# EAGLE schematic warp-revA (EAGLE 8.6.3)

## Sheet 1 of 5
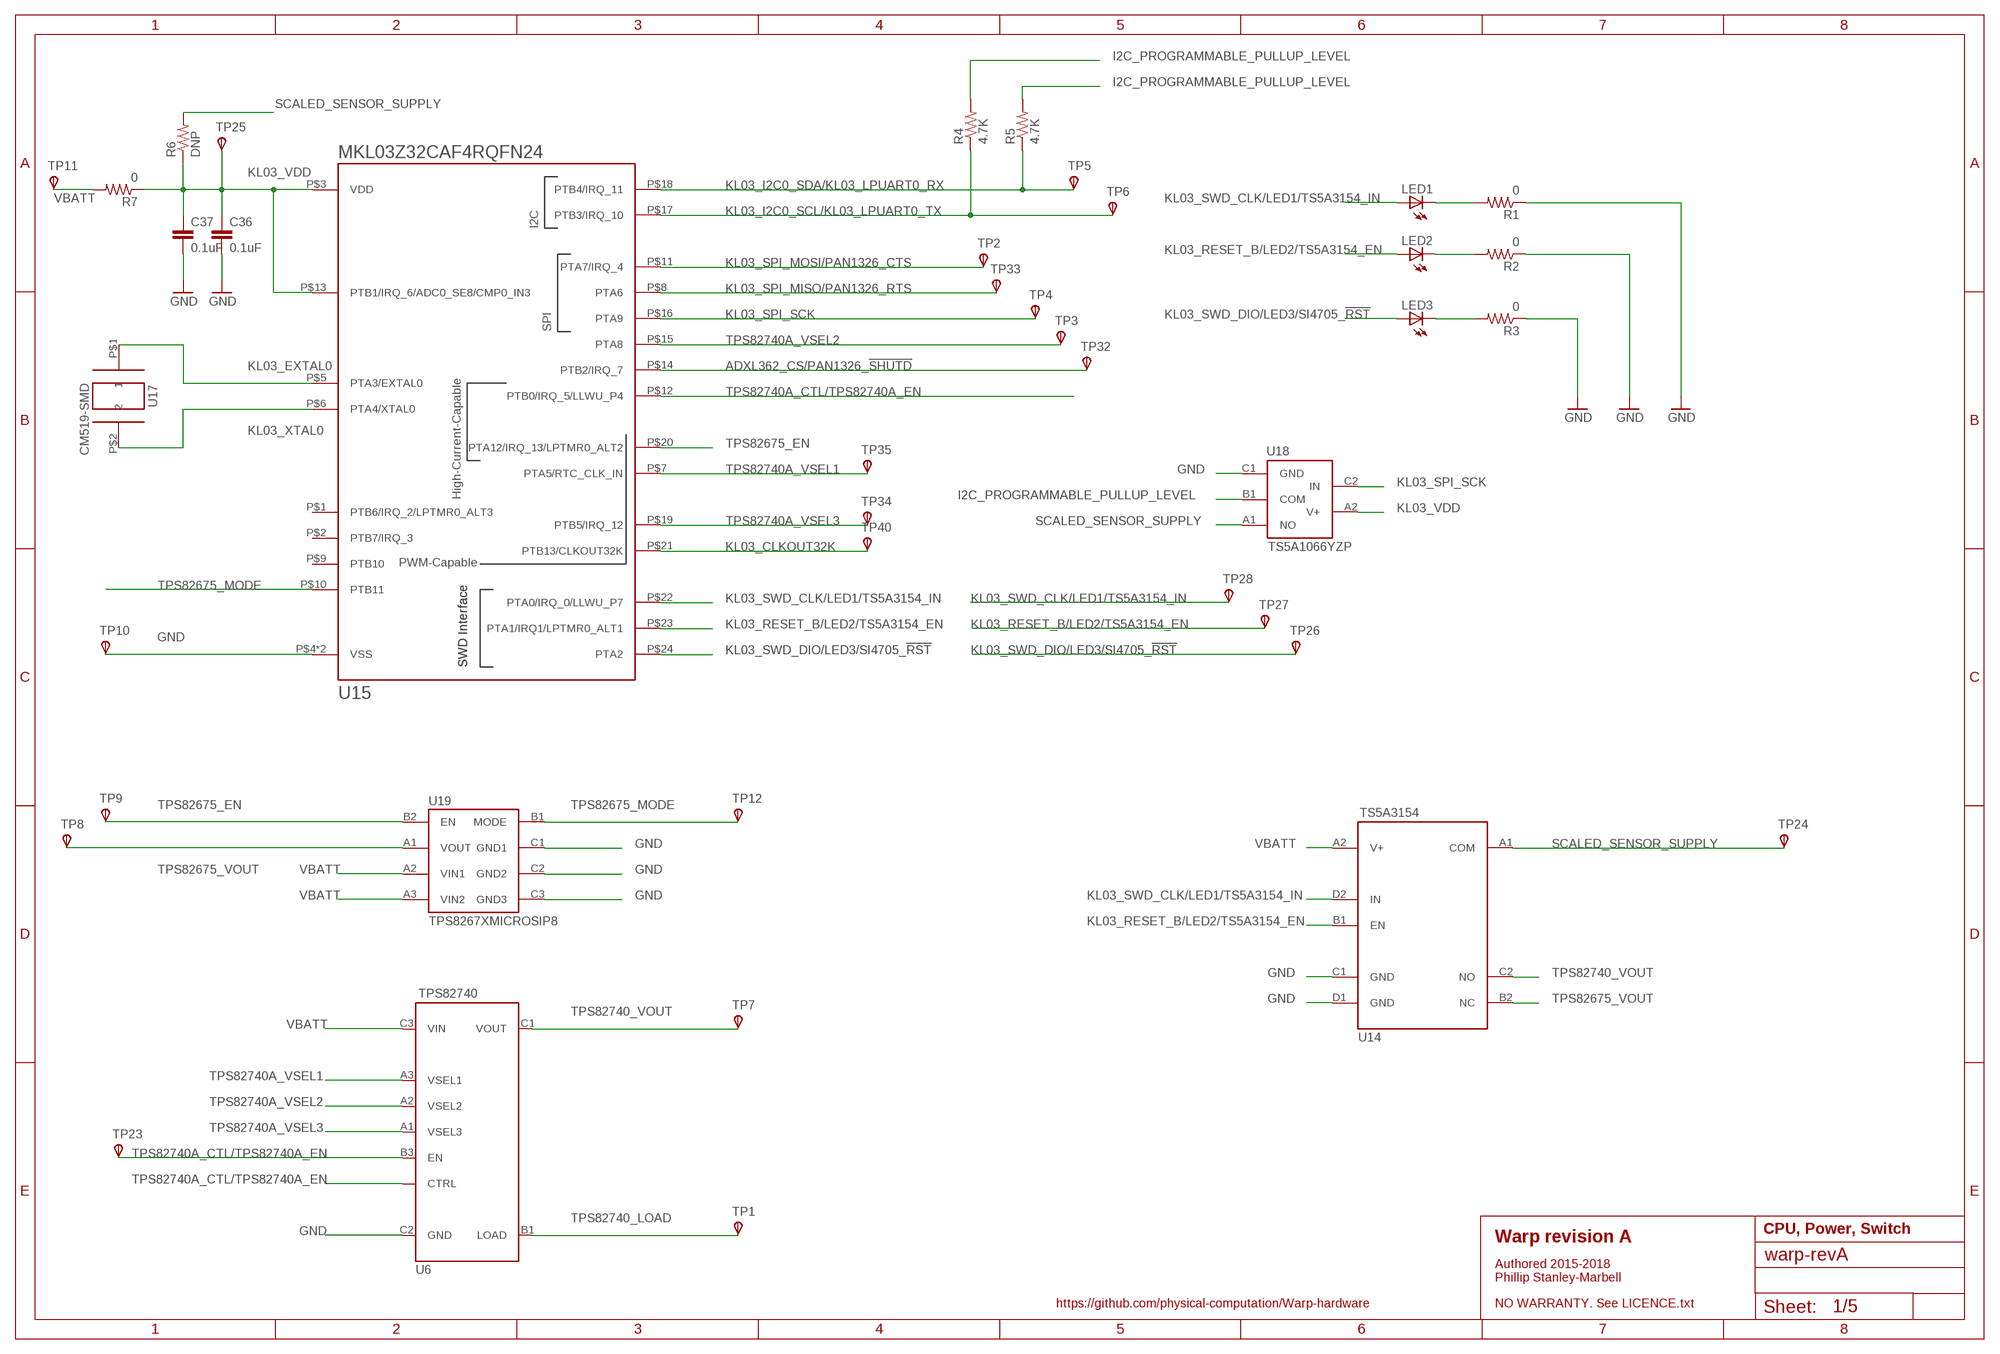
[diagram p0: schematic, sheet 1]

### Parts
C36  0.1uF  CAP0402-CAP  [0402-CAP]
C37  0.1uF  CAP0402-CAP  [0402-CAP]
LED1  LEDSML0603  [SML0603]
LED2  LEDSML0603  [SML0603]
LED3  LEDSML0603  [SML0603]
R1  0  RESISTOR0402-RES  [0402-RES]
R2  0  RESISTOR0402-RES  [0402-RES]
R3  0  RESISTOR0402-RES  [0402-RES]
R4  4.7K  RESISTOR0402-RES  [0402-RES]
R5  4.7K  RESISTOR0402-RES  [0402-RES]
R6  DNP  RESISTOR0402-RES  [0402-RES]
R7  0  RESISTOR0402-RES  [0402-RES]
TP1  TPSTP06R  [TP06R]
TP2  TPSTP06R  [TP06R]
TP3  TPSTP06R  [TP06R]
TP4  TPSTP06R  [TP06R]
TP5  TPSTP06R  [TP06R]
TP6  TPSTP06R  [TP06R]
TP7  TPSTP06R  [TP06R]
TP8  TPSTP06R  [TP06R]
TP9  TPSTP06R  [TP06R]
TP10  TPSTP06R  [TP06R]
TP11  TPSTP06R  [TP06R]
TP12  TPSTP06R  [TP06R]
TP23  TPSTP06R  [TP06R]
TP24  TPSTP06R  [TP06R]
TP25  TPSTP06R  [TP06R]
TP26  TPSTP06R  [TP06R]
TP27  TPSTP06R  [TP06R]
TP28  TPSTP06R  [TP06R]
TP32  TPSTP06R  [TP06R]
TP33  TPSTP06R  [TP06R]
TP34  TPSTP06R  [TP06R]
TP35  TPSTP06R  [TP06R]
TP40  TPSTP06R  [TP06R]
U6  TPS82740  [TPS82740]
U14  TS5A3154  [TS5A3154]
U15  MKL03Z32CAF4RQFN24  [MKL03Z32VFK4R]
U17  CM519-SMD  [CM519]
U18  TS5A1066YZP  [R-XBGA-N5]
U19  TPS8267XMICROSIP8  [MICROSIP-8]

### Nets
ADXL362_CS/PAN1326_!SHUTD: TP32.TP(PP) U15.P$14(PTB2/IRQ_7) ; also sheet 2,3
GND: C36.2 C37.2 R1.1 R2.1 R3.1 TP10.TP(PP) U6.C2(GND) U14.C1(GND) U14.D1(GND) U15.P$4(VSS) U15.P$PAD(VSS) U18.C1(GND) U19.C1(GND1) U19.C2(GND2) U19.C3(GND3) ; also sheet 2,3,4,5
I2C_PROGRAMMABLE_PULLUP_LEVEL: R4.2 R5.2 U18.B1(COM)
KL03_CLKOUT32K: TP40.TP(PP) U15.P$21(PTB13/CLKOUT32K) ; also sheet 3
KL03_EXTAL0: U15.P$5(PTA3/EXTAL0) U17.P$1
KL03_I2C0_SCL/KL03_LPUART0_TX: R4.1 TP6.TP(PP) U15.P$17(PTB3/IRQ_10) ; also sheet 2,3
KL03_I2C0_SDA/KL03_LPUART0_RX: R5.1 TP5.TP(PP) U15.P$18(PTB4/IRQ_11) ; also sheet 2,3
KL03_RESET_B/LED2/TS5A3154_EN: LED2.A TP27.TP(PP) U14.B1(EN) U15.P$23(PTA1/IRQ1/LPTMR0_ALT1) ; also sheet 5
KL03_SPI_MISO/PAN1326_RTS: TP33.TP(PP) U15.P$8(PTA6) ; also sheet 2,3
KL03_SPI_MOSI/PAN1326_CTS: TP2.TP(PP) U15.P$11(PTA7/IRQ_4) ; also sheet 2,3
KL03_SPI_SCK: TP4.TP(PP) U15.P$16(PTA9) U18.C2(IN) ; also sheet 2
KL03_SWD_CLK/LED1/TS5A3154_IN: LED1.A TP28.TP(PP) U14.D2(IN) U15.P$22(PTA0/IRQ_0/LLWU_P7) ; also sheet 5
KL03_SWD_DIO/LED3/SI4705_!RST: LED3.A TP26.TP(PP) U15.P$24(PTA2) ; also sheet 3,5
KL03_VDD: C36.1 C37.1 R6.1 R7.1 TP25.TP(PP) U15.P$3(VDD) U15.P$13(PTB1/IRQ_6/ADC0_SE8/CMP0_IN3) U18.A2(V+)
KL03_XTAL0: U15.P$6(PTA4/XTAL0) U17.P$2
N$1: LED1.C R1.2
N$2: LED2.C R2.2
N$3: LED3.C R3.2
SCALED_SENSOR_SUPPLY: R6.2 TP24.TP(PP) U14.A1(COM) U18.A1(NO) ; also sheet 2,3
TPS82675_EN: TP9.TP(PP) U15.P$20(PTA12/IRQ_13/LPTMR0_ALT2) U19.B2(EN)
TPS82675_MODE: TP12.TP(PP) U15.P$10(PTB11) U19.B1(MODE)
TPS82675_VOUT: TP8.TP(PP) U14.B2(NC) U19.A1(VOUT)
TPS82740_LOAD: TP1.TP(PP) U6.B1(LOAD)
TPS82740_VOUT: TP7.TP(PP) U6.C1(VOUT) U14.C2(NO)
TPS82740A_CTL/TPS82740A_EN: TP23.TP(PP) U6.B2(CTRL) U6.B3(EN) U15.P$12(PTB0/IRQ_5/LLWU_P4)
TPS82740A_VSEL1: TP35.TP(PP) U6.A3(VSEL1) U15.P$7(PTA5/RTC_CLK_IN)
TPS82740A_VSEL2: TP3.TP(PP) U6.A2(VSEL2) U15.P$15(PTA8)
TPS82740A_VSEL3: TP34.TP(PP) U6.A1(VSEL3) U15.P$19(PTB5/IRQ_12)
VBATT: R7.2 TP11.TP(PP) U6.C3(VIN) U14.A2(V+) U19.A2(VIN1) U19.A3(VIN2) ; also sheet 4,5
Unconnected: U15.P$1(PTB6/IRQ_2/LPTMR0_ALT3) U15.P$2(PTB7/IRQ_3) U15.P$9(PTB10)

### Notes on the sheet
- CPU, Power, Switch
- Warp revision A
- Authored 2015-2018
  Phillip Stanley-Marbell
- https://github.com/physical-computation/Warp-hardware | NO WARRANTY. See LICENCE.txt

## Sheet 2 of 5
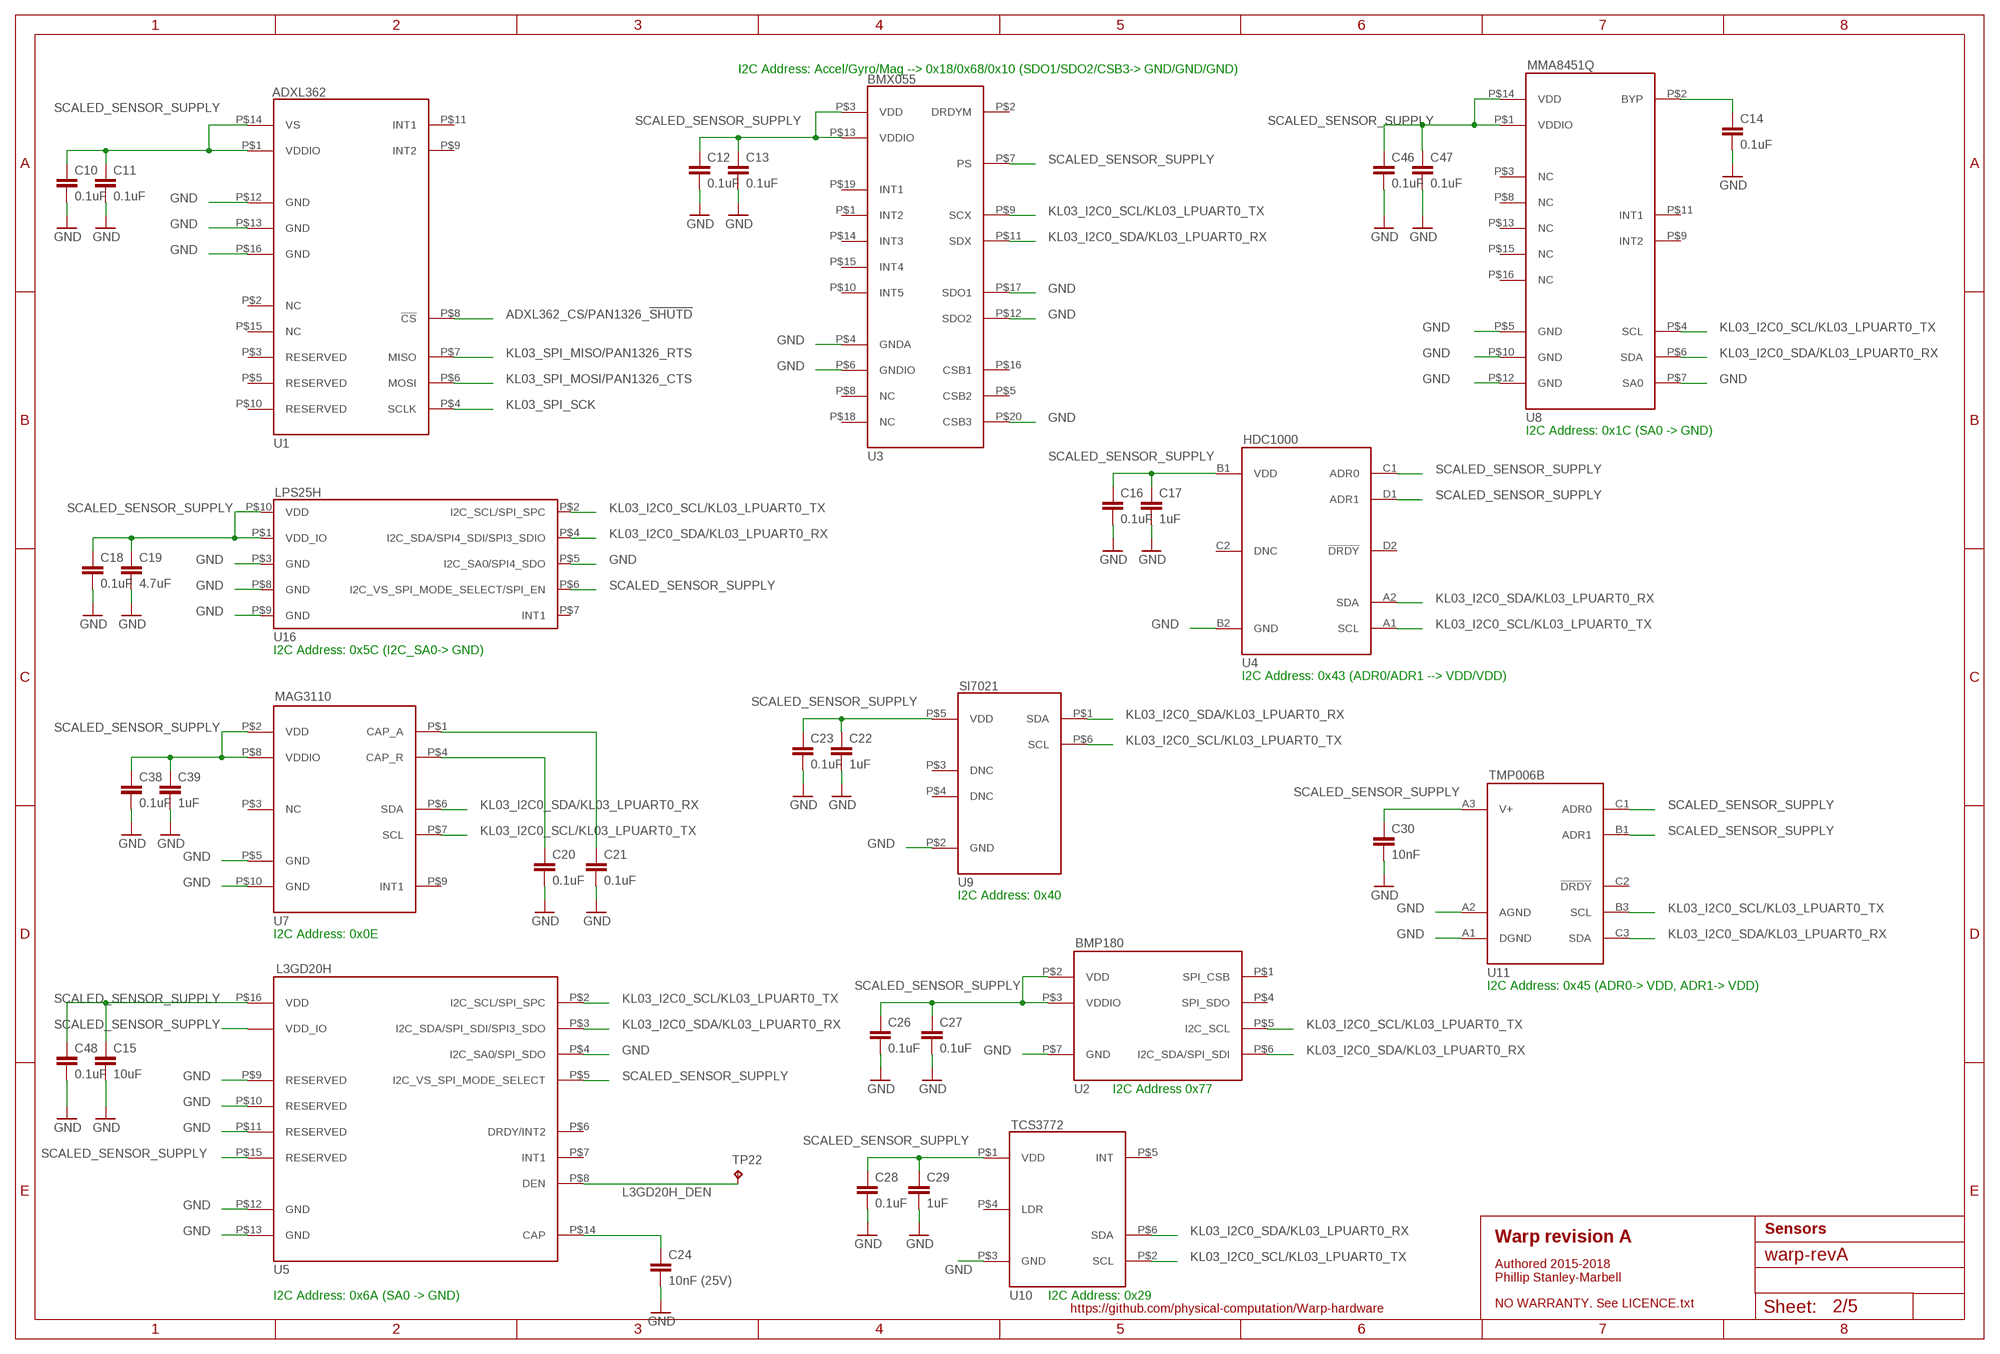
[diagram p1: schematic, sheet 2]

### Parts
C10  0.1uF  CAP0402-CAP  [0402-CAP]
C11  0.1uF  CAP0402-CAP  [0402-CAP]
C12  0.1uF  CAP0402-CAP  [0402-CAP]
C13  0.1uF  CAP0402-CAP  [0402-CAP]
C14  0.1uF  CAP0402-CAP  [0402-CAP]
C15  10uF  CAP0402-CAP  [0402-CAP]
C16  0.1uF  CAP0402-CAP  [0402-CAP]
C17  1uF  CAP0402-CAP  [0402-CAP]
C18  0.1uF  CAP0402-CAP  [0402-CAP]
C19  4.7uF  CAP0402-CAP  [0402-CAP]
C20  0.1uF  CAP0402-CAP  [0402-CAP]
C21  0.1uF  CAP0402-CAP  [0402-CAP]
C22  1uF  CAP0402-CAP  [0402-CAP]
C23  0.1uF  CAP0402-CAP  [0402-CAP]
C24  10nF (25V)  CAP0402-CAP  [0402-CAP]
C26  0.1uF  CAP0402-CAP  [0402-CAP]
C27  0.1uF  CAP0402-CAP  [0402-CAP]
C28  0.1uF  CAP0402-CAP  [0402-CAP]
C29  1uF  CAP0402-CAP  [0402-CAP]
C30  10nF  CAP0402-CAP  [0402-CAP]
C38  0.1uF  CAP0402-CAP  [0402-CAP]
C39  1uF  CAP0402-CAP  [0402-CAP]
C46  0.1uF  CAP0402-CAP  [0402-CAP]
C47  0.1uF  CAP0402-CAP  [0402-CAP]
C48  0.1uF  CAP0402-CAP  [0402-CAP]
TP22  TPTP06R  [TP06R]
U1  ADXL362  [ADXL362]
U2  BMP180  [BMP180]
U3  BMX055  [BMX055]
U4  HDC1000  [HDC1000]
U5  L3GD20H  [L3GD20H]
U7  MAG3110  [MAG3110]
U8  MMA8451Q  [MMA8451Q]
U9  SI7021  [SI7021]
U10  TCS3772  [TCS3772]
U11  TMP006B  [TMP006B]
U16  LPS25H  [LPS25H]

### Nets
ADXL362_CS/PAN1326_!SHUTD: U1.P$8(!CS) ; also sheet 1,3
GND: C10.2 C11.2 C12.2 C13.2 C14.2 C15.2 C16.2 C17.2 C18.2 C19.2 C20.2 C21.2 C22.2 C23.2 C24.2 C26.2 C27.2 C28.2 C29.2 C30.2 C38.2 C39.2 C46.2 C47.2 C48.2 U1.P$12(GND) U1.P$13(GND) U1.P$16(GND) U2.P$7(GND) U3.P$4(GNDA) U3.P$6(GNDIO) U3.P$12(SDO2) U3.P$17(SDO1) U3.P$20(CSB3) U4.B2(GND) U5.P$4(I2C_SA0/SPI_SDO) U5.P$9(RESERVED) U5.P$10(RESERVED) U5.P$11(RESERVED) U5.P$12(GND) U5.P$13(GND) U7.P$5(GND) U7.P$10(GND) U8.P$5(GND) U8.P$7(SA0) U8.P$10(GND) U8.P$12(GND) U9.P$2(GND) U10.P$3(GND) U11.A1(DGND) U11.A2(AGND) U16.P$3(GND) U16.P$5(I2C_SA0/SPI4_SDO) U16.P$8(GND) U16.P$9(GND) ; also sheet 1,3,4,5
KL03_I2C0_SCL/KL03_LPUART0_TX: U2.P$5(I2C_SCL) U3.P$9(SCX) U4.A1(SCL) U5.P$2(I2C_SCL/SPI_SPC) U7.P$7(SCL) U8.P$4(SCL) U9.P$6(SCL) U10.P$2(SCL) U11.B3(SCL) U16.P$2(I2C_SCL/SPI_SPC) ; also sheet 1,3
KL03_I2C0_SDA/KL03_LPUART0_RX: U2.P$6(I2C_SDA/SPI_SDI) U3.P$11(SDX) U4.A2(SDA) U5.P$3(I2C_SDA/SPI_SDI/SPI3_SDO) U7.P$6(SDA) U8.P$6(SDA) U9.P$1(SDA) U10.P$6(SDA) U11.C3(SDA) U16.P$4(I2C_SDA/SPI4_SDI/SPI3_SDIO) ; also sheet 1,3
KL03_SPI_MISO/PAN1326_RTS: U1.P$7(MISO) ; also sheet 1,3
KL03_SPI_MOSI/PAN1326_CTS: U1.P$6(MOSI) ; also sheet 1,3
KL03_SPI_SCK: U1.P$4(SCLK) ; also sheet 1
L3GD20H_DEN: TP22.TP U5.P$8(DEN)
N$104: C14.1 U8.P$2(BYP)
N$125: C21.1 U7.P$1(CAP_A)
N$126: C20.1 U7.P$4(CAP_R)
N$159: C24.1 U5.P$14(CAP)
SCALED_SENSOR_SUPPLY: C10.1 C11.1 C12.1 C13.1 C15.1 C16.1 C17.1 C18.1 C19.1 C22.1 C23.1 C26.1 C27.1 C28.1 C29.1 C30.1 C38.1 C39.1 C46.1 C47.1 C48.1 U1.P$1(VDDIO) U1.P$14(VS) U2.P$2(VDD) U2.P$3(VDDIO) U3.P$3(VDD) U3.P$7(PS) U3.P$13(VDDIO) U4.B1(VDD) U4.C1(ADR0) U4.D1(ADR1) U5.P$1(VDD_IO) U5.P$5(I2C_VS_SPI_MODE_SELECT) U5.P$15(RESERVED) U5.P$16(VDD) U7.P$2(VDD) U7.P$8(VDDIO) U8.P$1(VDDIO) U8.P$14(VDD) U9.P$5(VDD) U10.P$1(VDD) U11.A3(V+) U11.B1(ADR1) U11.C1(ADR0) U16.P$1(VDD_IO) U16.P$6(I2C_VS_SPI_MODE_SELECT/SPI_EN) U16.P$10(VDD) ; also sheet 1,3
Unconnected: U1.P$2(NC) U1.P$3(RESERVED) U1.P$5(RESERVED) U1.P$9(INT2) U1.P$10(RESERVED) U1.P$11(INT1) U1.P$15(NC) U2.P$1(SPI_CSB) U2.P$4(SPI_SDO) U3.P$1(INT2) U3.P$2(DRDYM) U3.P$5(CSB2) U3.P$8(NC) U3.P$10(INT5) U3.P$14(INT3) U3.P$15(INT4) U3.P$16(CSB1) U3.P$18(NC) U3.P$19(INT1) U4.C2(DNC) U4.D2(!DRDY) U5.P$6(DRDY/INT2) U5.P$7(INT1) U7.P$3(NC) U7.P$9(INT1) U8.P$3(NC) U8.P$8(NC) U8.P$9(INT2) U8.P$11(INT1) U8.P$13(NC) U8.P$15(NC) U8.P$16(NC) U9.P$3(DNC) U9.P$4(DNC) U10.P$4(LDR) U10.P$5(INT) U11.C2(!DRDY) U16.P$7(INT1)

### Notes on the sheet
- I2C Address: Accel/Gyro/Mag --> 0x18/0x68/0x10 (SDO1/SDO2/CSB3-> GND/GND/GND)
- I2C Address: 0x1C (SA0 -> GND)
- I2C Address: 0x5C (I2C_SA0-> GND)
- I2C Address: 0x43 (ADR0/ADR1 --> VDD/VDD)
- I2C Address: 0x40
- I2C Address: 0x0E
- I2C Address: 0x45 (ADR0-> VDD, ADR1-> VDD)
- I2C Address 0x77
- Sensors
- Warp revision A
- Authored 2015-2018
  Phillip Stanley-Marbell
- I2C Address: 0x6A (SA0 -> GND) | I2C Address: 0x29
- NO WARRANTY. See LICENCE.txt
- https://github.com/physical-computation/Warp-hardware

## Sheet 3 of 5
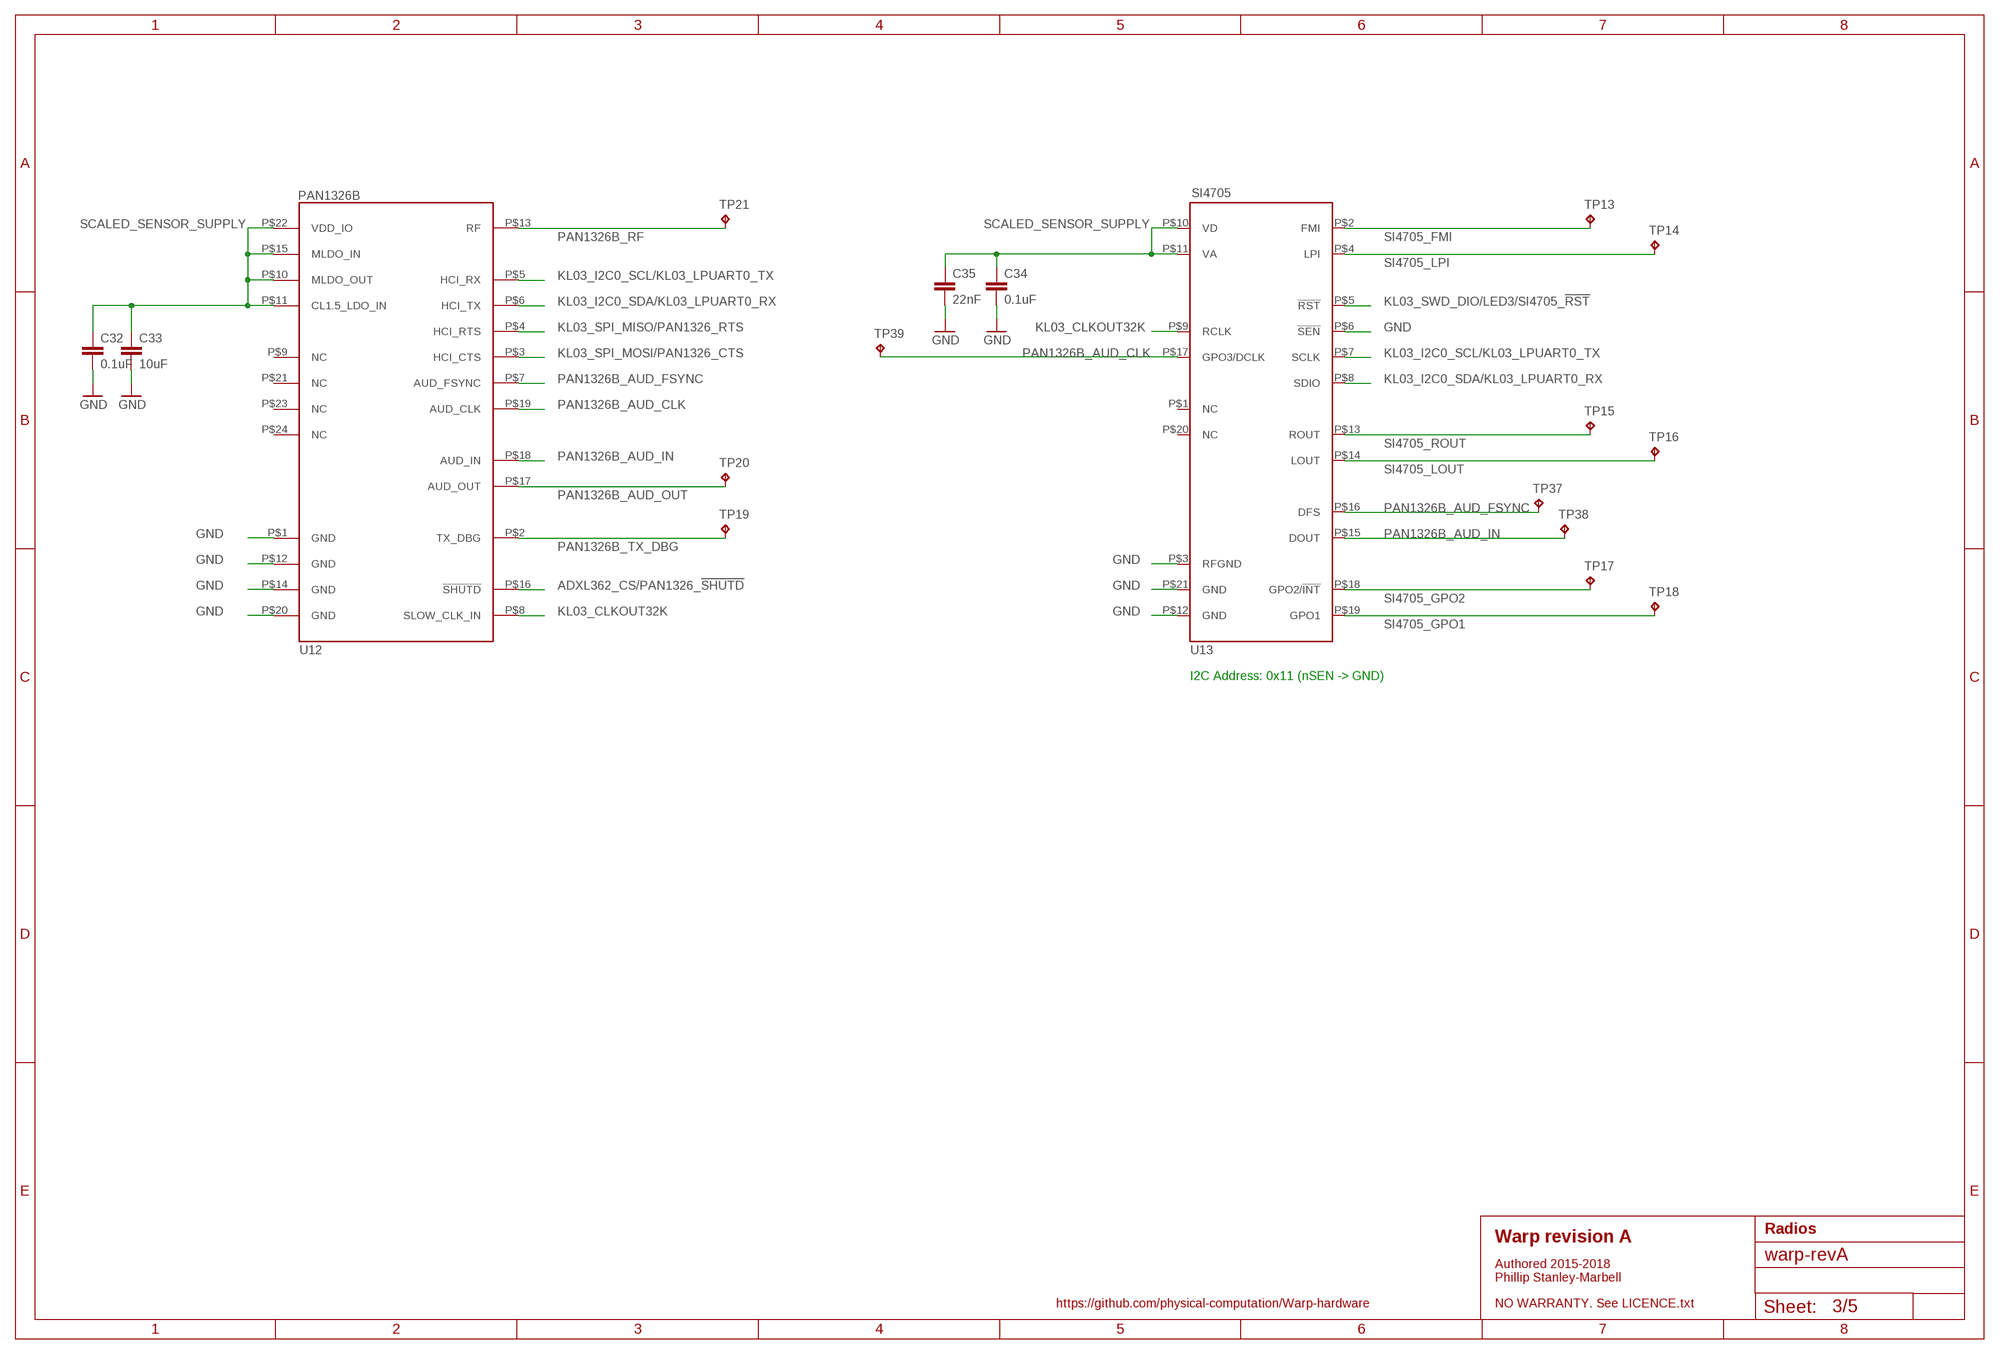
[diagram p2: schematic, sheet 3]

### Parts
C32  0.1uF  CAP0402-CAP  [0402-CAP]
C33  10uF  CAP0402-CAP  [0402-CAP]
C34  0.1uF  CAP0402-CAP  [0402-CAP]
C35  22nF  CAP0402-CAP  [0402-CAP]
TP13  TPTP06R  [TP06R]
TP14  TPTP06R  [TP06R]
TP15  TPTP06R  [TP06R]
TP16  TPTP06R  [TP06R]
TP17  TPTP06R  [TP06R]
TP18  TPTP06R  [TP06R]
TP19  TPTP06R  [TP06R]
TP20  TPTP06R  [TP06R]
TP21  TPTP06R  [TP06R]
TP37  TPTP06R  [TP06R]
TP38  TPTP06R  [TP06R]
TP39  TPTP06R  [TP06R]
U12  PAN1326B  [PAN1326B]
U13  SI4705  [SI4705]

### Nets
ADXL362_CS/PAN1326_!SHUTD: U12.P$16(!SHUTD) ; also sheet 1,2
GND: C32.2 C33.2 C34.2 C35.2 U12.P$1(GND) U12.P$12(GND) U12.P$14(GND) U12.P$20(GND) U13.P$3(RFGND) U13.P$6(!SEN) U13.P$12(GND) U13.P$21(GND) ; also sheet 1,2,4,5
KL03_CLKOUT32K: U12.P$8(SLOW_CLK_IN) U13.P$9(RCLK) ; also sheet 1
KL03_I2C0_SCL/KL03_LPUART0_TX: U12.P$5(HCI_RX) U13.P$7(SCLK) ; also sheet 1,2
KL03_I2C0_SDA/KL03_LPUART0_RX: U12.P$6(HCI_TX) U13.P$8(SDIO) ; also sheet 1,2
KL03_SPI_MISO/PAN1326_RTS: U12.P$4(HCI_RTS) ; also sheet 1,2
KL03_SPI_MOSI/PAN1326_CTS: U12.P$3(HCI_CTS) ; also sheet 1,2
KL03_SWD_DIO/LED3/SI4705_!RST: U13.P$5(!RST) ; also sheet 1,5
PAN1326B_AUD_CLK: TP39.TP U12.P$19(AUD_CLK) U13.P$17(GPO3/DCLK)
PAN1326B_AUD_FSYNC: TP37.TP U12.P$7(AUD_FSYNC) U13.P$16(DFS)
PAN1326B_AUD_IN: TP38.TP U12.P$18(AUD_IN) U13.P$15(DOUT)
PAN1326B_AUD_OUT: TP20.TP U12.P$17(AUD_OUT)
PAN1326B_RF: TP21.TP U12.P$13(RF)
PAN1326B_TX_DBG: TP19.TP U12.P$2(TX_DBG)
SCALED_SENSOR_SUPPLY: C32.1 C33.1 C34.1 C35.1 U12.P$10(MLDO_OUT) U12.P$11(CL1.5_LDO_IN) U12.P$15(MLDO_IN) U12.P$22(VDD_IO) U13.P$10(VD) U13.P$11(VA) ; also sheet 1,2
SI4705_FMI: TP13.TP U13.P$2(FMI)
SI4705_GPO1: TP18.TP U13.P$19(GPO1)
SI4705_GPO2: TP17.TP U13.P$18(GPO2/!INT)
SI4705_LOUT: TP16.TP U13.P$14(LOUT)
SI4705_LPI: TP14.TP U13.P$4(LPI)
SI4705_ROUT: TP15.TP U13.P$13(ROUT)
Unconnected: U12.P$9(NC) U12.P$21(NC) U12.P$23(NC) U12.P$24(NC) U13.P$1(NC) U13.P$20(NC)

### Notes on the sheet
- I2C Address: 0x11 (nSEN -> GND)
- Radios
- Warp revision A
- Authored 2015-2018
  Phillip Stanley-Marbell
- https://github.com/physical-computation/Warp-hardware | NO WARRANTY. See LICENCE.txt

## Sheet 4 of 5
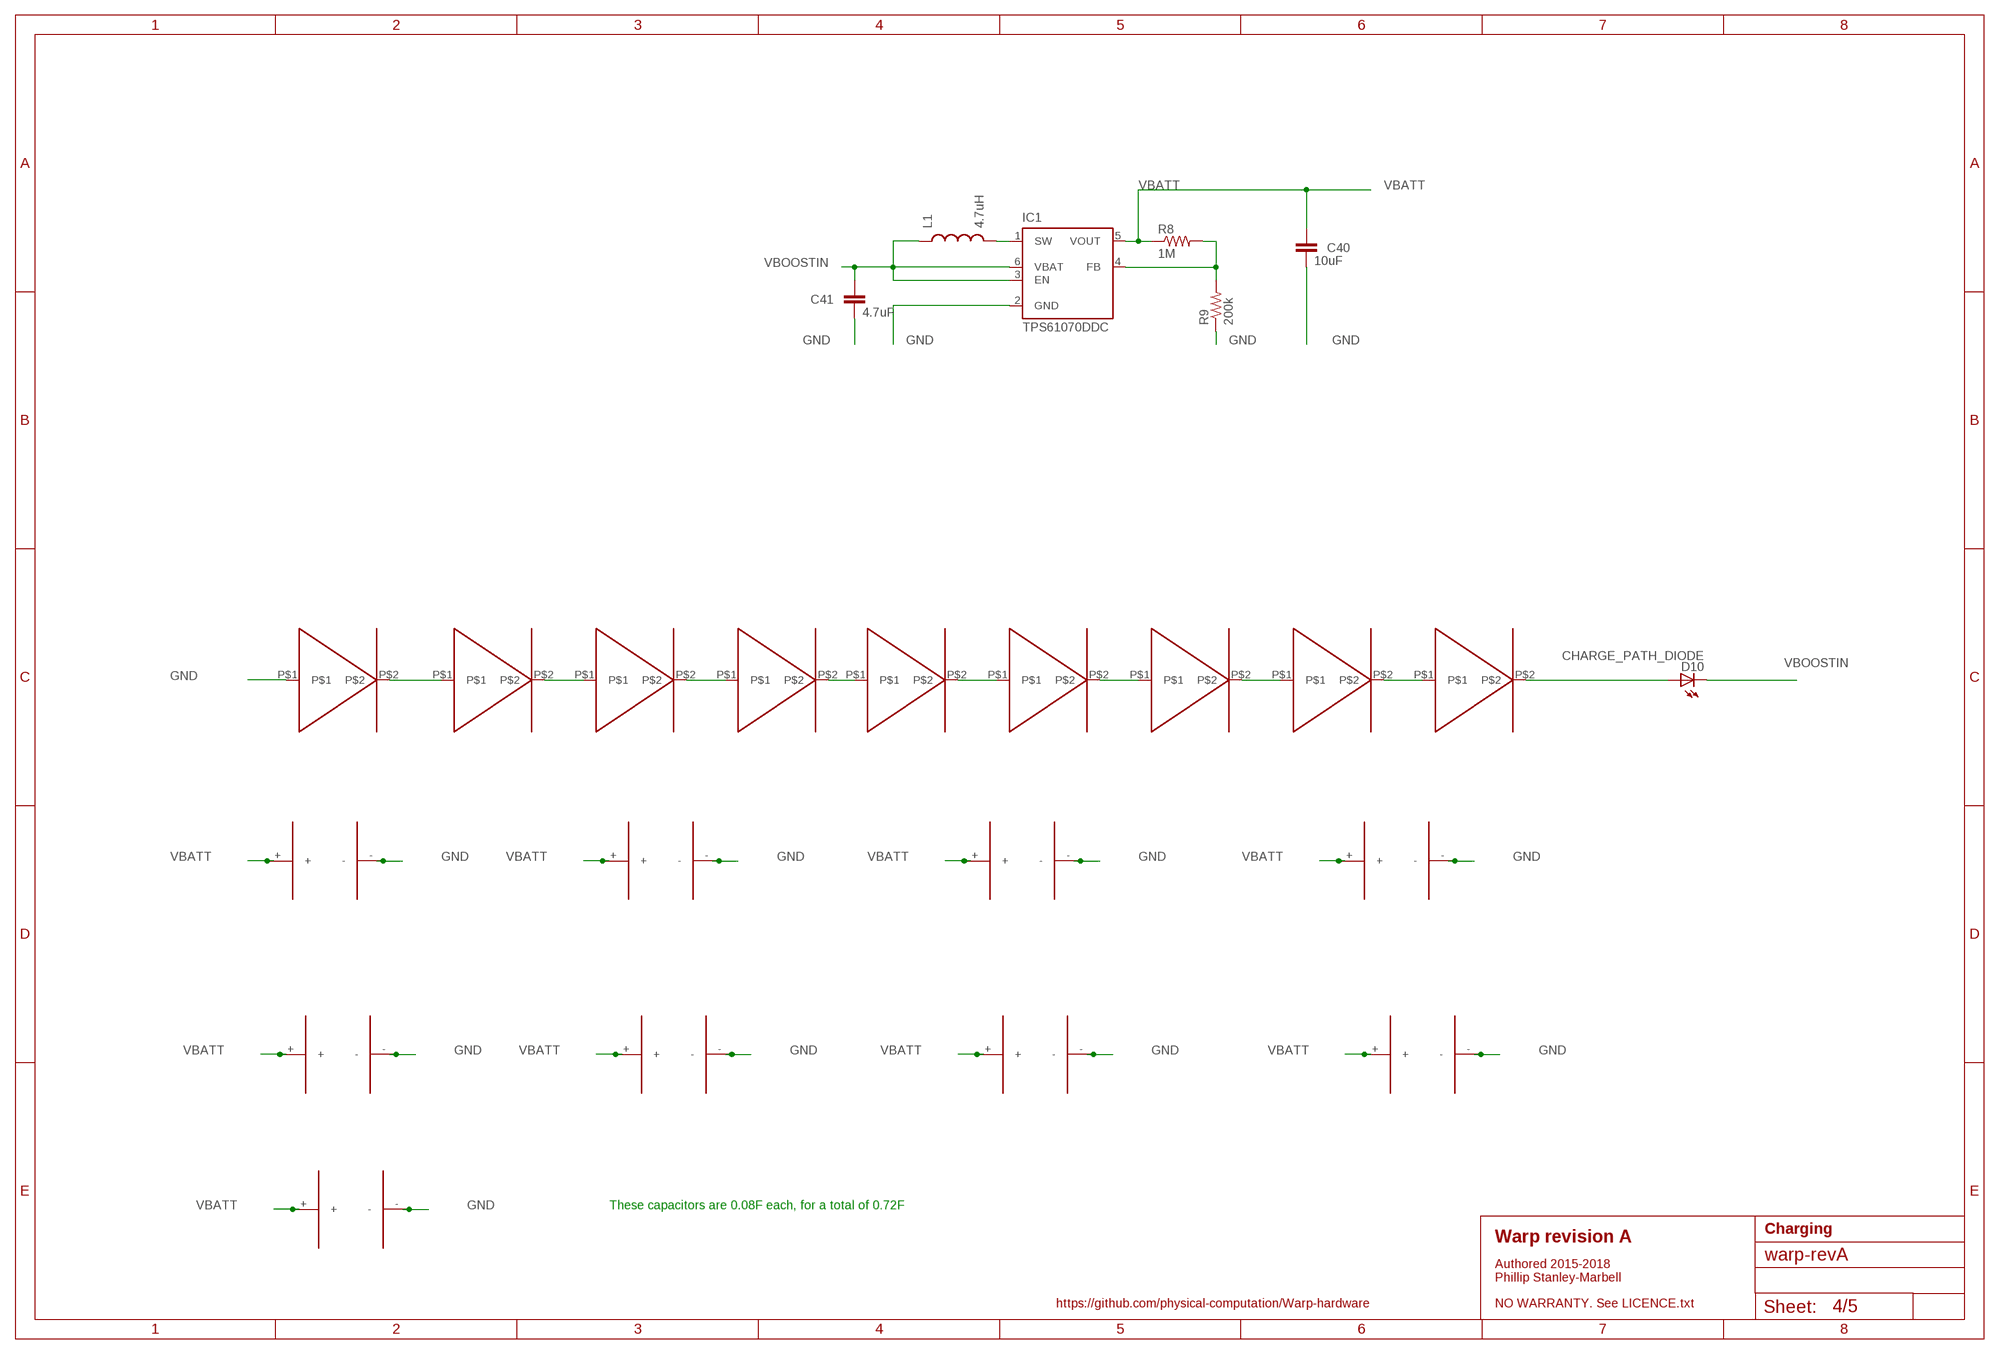
[diagram p3: schematic, sheet 4]

### Parts
C1  XH414HGIV01E  [XH414HGIV01E]
C2  XH414HGIV01E  [XH414HGIV01E]
C3  XH414HGIV01E  [XH414HGIV01E]
C4  XH414HGIV01E  [XH414HGIV01E]
C5  XH414HGIV01E  [XH414HGIV01E]
C6  XH414HGIV01E  [XH414HGIV01E]
C7  XH414HGIV01E  [XH414HGIV01E]
C8  XH414HGIV01E  [XH414HGIV01E]
C9  XH414HGIV01E  [XH414HGIV01E]
C40  10uF  CAP0402-CAP  [0402-CAP]
C41  4.7uF  CAP0402-CAP  [0402-CAP]
D1  TEMD5080  [TEMD5080]
D2  TEMD5080  [TEMD5080]
D3  TEMD5080  [TEMD5080]
D4  TEMD5080  [TEMD5080]
D5  TEMD5080  [TEMD5080]
D6  TEMD5080  [TEMD5080]
D7  TEMD5080  [TEMD5080]
D8  TEMD5080  [TEMD5080]
D9  TEMD5080  [TEMD5080]
D10  CHARGE_PATH_DIODE  LEDSML0603  [SML0603]
IC1  TPS61070DDC  [TSOT23-6_DDC]
L1  4.7uH  INDUCTOR0603  [0603]
R8  1M  RESISTOR0402-RES  [0402-RES]
R9  200k  RESISTOR0402-RES  [0402-RES]

### Nets
GND: C1.- C2.- C3.- C4.- C5.- C6.- C7.- C8.- C9.- C40.2 C41.2 D1.P$1 IC1.2(GND) R9.1 ; also sheet 1,2,3,5
N$5: IC1.1(SW) L1.2
N$6: IC1.4(FB) R8.2 R9.2
N$236: D1.P$2 D2.P$1
N$237: D2.P$2 D3.P$1
N$238: D3.P$2 D4.P$1
N$239: D4.P$2 D5.P$1
N$240: D5.P$2 D6.P$1
N$241: D6.P$2 D7.P$1
N$242: D7.P$2 D8.P$1
N$243: D8.P$2 D9.P$1
N$244: D9.P$2 D10.A
VBATT: C1.+ C2.+ C3.+ C4.+ C5.+ C6.+ C7.+ C8.+ C9.+ C40.1 IC1.5(VOUT) R8.1 ; also sheet 1,5
VBOOSTIN: C41.1 D10.C IC1.3(EN) IC1.6(VBAT) L1.1

### Notes on the sheet
- These capacitors are 0.08F each, for a total of 0.72F
- Charging
- Warp revision A
- Authored 2015-2018
  Phillip Stanley-Marbell
- https://github.com/physical-computation/Warp-hardware | NO WARRANTY. See LICENCE.txt

## Sheet 5 of 5
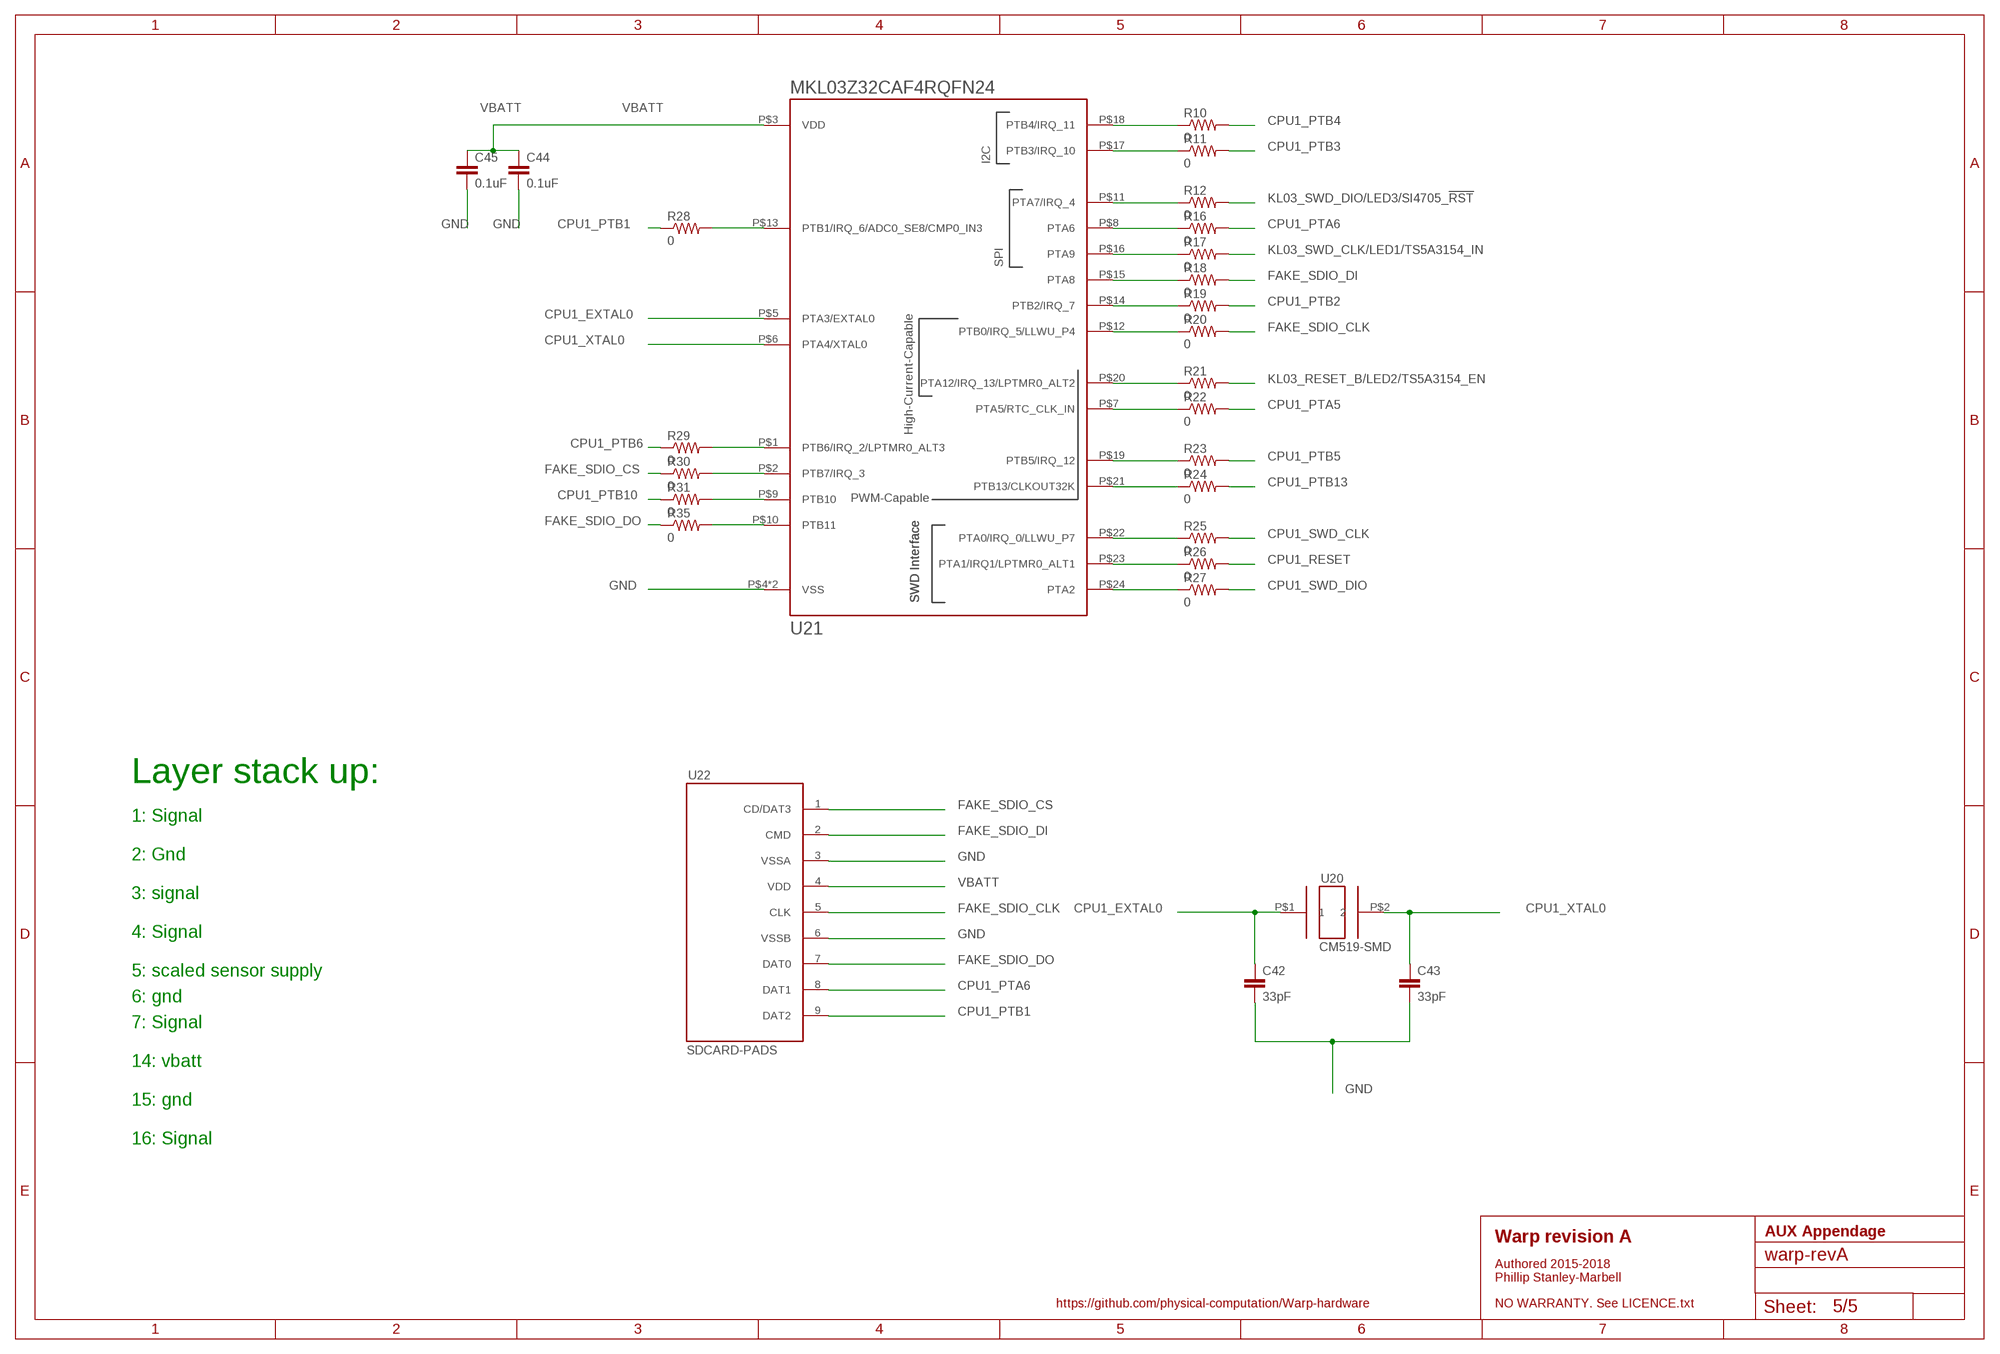
[diagram p4: schematic, sheet 5]

### Parts
C42  33pF  CAP0402-CAP  [0402-CAP]
C43  33pF  CAP0402-CAP  [0402-CAP]
C44  0.1uF  CAP0402-CAP  [0402-CAP]
C45  0.1uF  CAP0402-CAP  [0402-CAP]
R10  0  RESISTOR0402-RES  [0402-RES]
R11  0  RESISTOR0402-RES  [0402-RES]
R12  0  RESISTOR0402-RES  [0402-RES]
R16  0  RESISTOR0402-RES  [0402-RES]
R17  0  RESISTOR0402-RES  [0402-RES]
R18  0  RESISTOR0402-RES  [0402-RES]
R19  0  RESISTOR0402-RES  [0402-RES]
R20  0  RESISTOR0402-RES  [0402-RES]
R21  0  RESISTOR0402-RES  [0402-RES]
R22  0  RESISTOR0402-RES  [0402-RES]
R23  0  RESISTOR0402-RES  [0402-RES]
R24  0  RESISTOR0402-RES  [0402-RES]
R25  0  RESISTOR0402-RES  [0402-RES]
R26  0  RESISTOR0402-RES  [0402-RES]
R27  0  RESISTOR0402-RES  [0402-RES]
R28  0  RESISTOR0402-RES  [0402-RES]
R29  0  RESISTOR0402-RES  [0402-RES]
R30  0  RESISTOR0402-RES  [0402-RES]
R31  0  RESISTOR0402-RES  [0402-RES]
R35  0  RESISTOR0402-RES  [0402-RES]
U20  CM519-SMD  [CM519]
U21  MKL03Z32CAF4RQFN24  [MKL03Z32VFK4R]
U22  SDCARD-PADS  [SDCARD-PADS]

### Nets
CPU1_EXTAL0: C42.1 U20.P$1 U21.P$5(PTA3/EXTAL0)
CPU1_PTA5: R22.2
CPU1_PTA6: R16.2 U22.8(DAT1)
CPU1_PTB1: R28.1 U22.9(DAT2)
CPU1_PTB2: R19.2
CPU1_PTB3: R11.2
CPU1_PTB4: R10.2
CPU1_PTB5: R23.2
CPU1_PTB6: R29.1
CPU1_PTB10: R31.1
CPU1_PTB13: R24.2
CPU1_RESET: R26.2
CPU1_SWD_CLK: R25.2
CPU1_SWD_DIO: R27.2
CPU1_XTAL0: C43.1 U20.P$2 U21.P$6(PTA4/XTAL0)
FAKE_SDIO_CLK: R20.2 U22.5(CLK)
FAKE_SDIO_CS: R30.1 U22.1(CD/DAT3)
FAKE_SDIO_DI: R18.2 U22.2(CMD)
FAKE_SDIO_DO: R35.1 U22.7(DAT0)
GND: C42.2 C43.2 C44.2 C45.2 U21.P$4(VSS) U21.P$PAD(VSS) U22.3(VSSA) U22.6(VSSB) ; also sheet 1,2,3,4
KL03_RESET_B/LED2/TS5A3154_EN: R21.2 ; also sheet 1
KL03_SWD_CLK/LED1/TS5A3154_IN: R17.2 ; also sheet 1
KL03_SWD_DIO/LED3/SI4705_!RST: R12.2 ; also sheet 1,3
N$15: R28.2 U21.P$13(PTB1/IRQ_6/ADC0_SE8/CMP0_IN3)
N$16: R29.2 U21.P$1(PTB6/IRQ_2/LPTMR0_ALT3)
N$21: R30.2 U21.P$2(PTB7/IRQ_3)
N$22: R31.2 U21.P$9(PTB10)
N$23: R35.2 U21.P$10(PTB11)
N$24: R10.1 U21.P$18(PTB4/IRQ_11)
N$25: R11.1 U21.P$17(PTB3/IRQ_10)
N$26: R12.1 U21.P$11(PTA7/IRQ_4)
N$27: R16.1 U21.P$8(PTA6)
N$28: R17.1 U21.P$16(PTA9)
N$30: R18.1 U21.P$15(PTA8)
N$31: R19.1 U21.P$14(PTB2/IRQ_7)
N$32: R20.1 U21.P$12(PTB0/IRQ_5/LLWU_P4)
N$33: R21.1 U21.P$20(PTA12/IRQ_13/LPTMR0_ALT2)
N$34: R22.1 U21.P$7(PTA5/RTC_CLK_IN)
N$35: R23.1 U21.P$19(PTB5/IRQ_12)
N$36: R24.1 U21.P$21(PTB13/CLKOUT32K)
N$37: R25.1 U21.P$22(PTA0/IRQ_0/LLWU_P7)
N$38: R26.1 U21.P$23(PTA1/IRQ1/LPTMR0_ALT1)
N$39: R27.1 U21.P$24(PTA2)
VBATT: C44.1 C45.1 U21.P$3(VDD) U22.4(VDD) ; also sheet 1,4

### Notes on the sheet
- Layer stack up:
- 1: Signal
- 2: Gnd
- 3: signal
- 4: Signal
- 5: scaled sensor supply
- 6: gnd
- 7: Signal
- 14: vbatt
- 15: gnd
- 16: Signal
- AUX Appendage
- Warp revision A
- Authored 2015-2018
  Phillip Stanley-Marbell
- https://github.com/physical-computation/Warp-hardware | NO WARRANTY. See LICENCE.txt

## Library data of the parts
C1-C9 = XH414HGIV01E:XH414HGIV01E: XH414HGIV01E XH-HG Capacitor.
C10-C24 C26-C30 C32-C48 = SparkFun-Passives:CAP: Capacitor Standard 0603 ceramic capacitor, and 0.1" leaded capacitor.
D1-D9 = TEMD5080:TEMD5080: TEMD5080 Silicon PIN Photodiode.
D10 LED1-LED3 = led:LED: LED OSRAM: - CHIPLED LG R971, LG N971, LY N971, LG Q971, LY Q971, LO R971, LY R971 LH N974, LH R974 LS Q976, LO Q976, LY Q976 LO Q996 - Hyper CHIPLED LW Q18S LB Q993, LB Q99A, LB R99A - SideLED LS A670, LO A670, LY A670, LG A670, LP A670 LB A673, LV A673, LT A673, LW A673 LH A674 LY A675 LS A676, LA A676, LO A676, LY A676, LW A676 LS A679, LY A679, LG A679 - Hyper Micro SIDELED® LS Y876, LA Y876, LO Y876, LY Y876 LT Y87S - SmartLED LW L88C, LW L88S LB L89C, LB L89S, LG L890 LS L89K, LO L89K, LY L89K LS L896, LA L896, LO L896, LY L896 - TOPLED LS T670, LO T670, LY T670, LG T670, LP T670 LSG T670, LSP T670, LSY T670, LOP T670, LYG T670 LG T671, LOG T671, LSG T671 LB T673, LV T673, LT T673, LW T673 LH T674 LS T676, LA T676, LO T676, LY T676, LB T676, LH T676, LSB T676, LW T676 LB T67C, LV T67C, LT T67C, LS T67K, LO T67K, LY T67K, LW E67C LS E67B, LA E67B, LO E67B, LY E67B, LB E67C, LV E67C, LT E67C LW T67C LS T679, LY T679, LG T679 LS T770, LO T770, LY T770, LG T770, LP T770 LB T773, LV T773, LT T773, LW T773 LH T774 LS E675, LA E675, LY E675, LS T675 LS T776, LA T776, LO T776, LY T776, LB T776 LHGB T686 LT T68C, LB T68C - Hyper Mini TOPLED® LB M676 - Mini TOPLED Santana® LG M470 LS M47K, LO M47K, LY M47K Source: http://www.osram.convergy.de LUXEON: - LUMILED® LXK2-PW12-R00, LXK2-PW12-S00, LXK2-PW14-U00, LXK2-PW14-V00 LXK2-PM12-R00, LXK2-PM12-S00, LXK2-PM14-U00 LXK2-PE12-Q00, LXK2-PE12-R00, LXK2-PE12-S00, LXK2-PE14-T00, LXK2-PE14-U00 LXK2-PB12-K00, LXK2-PB12-L00, LXK2-PB12-M00, LXK2-PB14-N00, LXK2-PB14-P00, LXK2-PB14-Q00 LXK2-PR12-L00, LXK2-PR12-M00, LXK2-PR14-Q00, LXK2-PR14-R00 LXK2-PD12-Q00, LXK2-PD12-R00, LXK2-PD12-S00 LXK2-PH12-R00, LXK2-PH12-S00 LXK2-PL12-P00, LXK2-PL12-Q00, LXK2-PL12-R00 Source: www.luxeon.com KINGBRIGHT: KA-3528ASYC Source: www.kingbright.com
IC1 = texas:TPS6107*: 90% EFFICIENT SYNCHRONOUS BOOST CONVERTER WITH 600-mA SWITCH Source: http://focus.ti.com/lit/ds/symlink/tps61070.pdf; MPN: TPS61070DDCR; OC_FARNELL: 1461062; OC_NEWARK: 64M3125
L1 = SparkFun-Passives:INDUCTOR: Inductors Basic Inductor/Choke - 0603 and 1206. Footprints are not proven and vary greatly between part numbers. SRN6045- 33uH, 20% 1.4A SDR0403-560KL - 56uH, 10%, 500mA RMS/740mA peak
R1-R12 R16-R31 R35 = SparkFun-Passives:RESISTOR: Resistor Basic schematic elements and footprints for 0603, 1206, and PTH resistors.
TP1-TP12 TP23-TP28 TP32-TP35 TP40 = testpad:TPS: TEST PIN
TP13-TP22 TP37-TP39 = testpad:TP: Test pad
U1 = ADXL362:ADXL362: ADXL362, Micropower, 3-Axis, ±2 g/±4 g/±8 g Digital Output MEMS Accelerometer.
U2 = BMP180:BMP180: BMP180 Digital pressure sensor
U3 = BMX055:BMX055: BMX055 Small, versatile 9-axis sensor module (accelerometer, gyro, and magnetometer).
U4 = HDC1000:HDC1000: HDC1000 Low Power, High Accuracy Digital Humidity Sensor with Temperature Sensor.
U5 = L3GD20H:L3GD20H: L3GD20H MEMS motion sensor: three-axis digital output gyroscope.
U6 = TPS82740:TPS82740: TPS82740x 360nA IQ MicroSIP Step Down Converter Module for Low Power Applications.
U7 = MAG3110:MAG3110: MAG3110 Three-Axis, Digital Magnetometer.
U8 = MMA8451Q:MMA8451Q: MMA8451Q 3-Axis, 14-bit/8-bit Digital Accelerometer.
U9 = SI7021:SI7021: I2C HUMIDITY AND TEMPERATURE SENSOR.
U10 = TCS3772:TCS3772: TCS3772 COLOR LIGHT-TO-DIGITAL CONVERTER with PROXIMITY SENSING.
U11 = TMP006B:TMP006B: TMP006/B Infrared Thermopile Sensor in Chip-Scale Package.
U12 = PAN1326B:PAN1326B: PAN1326B HCI Class 1.5 TI-based Bluetooth module.
U13 = SI4705:SI4705: Si4705 BROADCAST FM RADIO RECEIVER FOR CONSUMER ELECTRONICS.
U14 = TS5A3154:TS5A3154: 0.9-ΩSPDT ANALOG SWITCH 5-V/3.3-V SINGLE-CHANNEL 2:1 MULTIPLEXER/DEMULTIPLEXER
U15 U21 = MKL03Z32CAF4R:MKL03Z32CAF4R: Kinetis KL03 32 KB Flash, 48 MHz Cortex-M0+ Microcontroller, in WLCSP package (MKL03Z32CAF4R), as well as using the logical pins available in the 20-pin MKL03Z32CAF4R, for the 24-pin MKL03Z32VFK4R, connecting the additional pins in the MKL03Z32VFK4R to ground.
U16 = LPS25H:LPS25H: LPS25H MEMS pressure sensor: 260-1260 hPa absolute digital output barometer
U17 U20 = CM519:CM519
U18 = TS5A1066:TS5A1066: The TS5A1066 is a single-pole single-throw (SPST) analog switch that is designed to operate from 1.65 V to 5.5 V. This device can handle both digital and analog signals, and signals up to V+ (peak) can be transmitted in either direction.
U19 = TPS8267x:TPS8267X: TPS8267x miniature system-in-package switching regulator.
U22 = SDCARD-pads:SDCARD-PADS: Pads for full-size SD card